# EasyEDA schematic easyeda_source_code.json
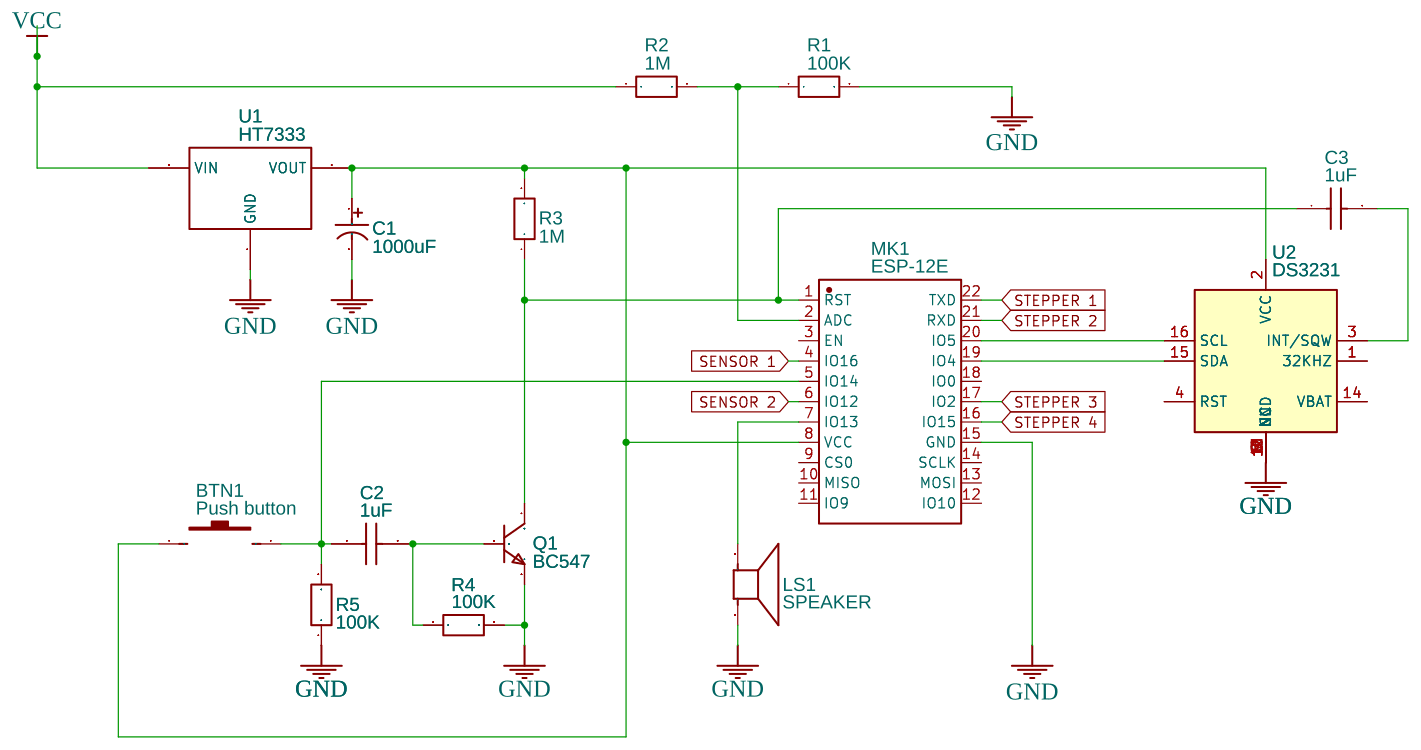
[diagram p0: schematic sheet]

## Parts
BTN1  Push button  [KEY-3.0*4.0]
C1  1000uF  [CAP-TH_BD10.0-P5.00-D1.0-FD]
C2  1uF  [&#126;]
C3  1uF  [&#126;]
LS1  SPEAKER  [PS12]
MK1  ESP-12E  [WIFIM-SMD_ESP-12E]
Q1  BC547  [TO-92-3_L4.8-W3.7-P2.54-L]
R1  100K  [R0201]
R2  1M  [R0201]
R3  1M  [R0201]
R4  100K  [R0201]
R5  100K  [R0201]
U1  HT7333  [TO-92-3_L5.1-W4.1-P1.27-L]
U2  DS3231  [SOIC-16_7.5X10.3MM_PITCH1.27MM]

## Library data of the parts
BTN1 = Switch3x4x2: Supplier: LCSC; Manufacturer: ReliaPro; Supplier Part: C26638
C1 = 1000uF 10V 10*15: Supplier: LCSC; Manufacturer: ValuePro; Manufacturer Part: 1000uF 10V绿金 10*15; Supplier Part: C43339
C2 C3 = CAPACITOR_RevE_Date15jun2010: Contributor: KiCAD; license: https://www.gnu.org/licenses/lgpl-2.1.html
LS1 = SPEAKERPS12: SPEAKER Source: BuerklinAdded PS12 (for part # PS1240 piezo) http:www.ladyada.netlibrarypcbeaglelibrary.html; Contributor: Adafruit
MK1 = ESP-12E: Supplier: LCSC; Manufacturer: Ai-Thinker; Supplier Part: C89297
Q1 = BC547BTA: Supplier: LCSC; Supplier Part: C258144; Manufacturer: ON Semicon; Contributor: LCSC
R1-R5 = R_0201_EU: Contributor: LCEDA_Lib
U1 = HT7333-A_C73726: Supplier: LCSC; Supplier Part: C73726; Manufacturer: Holtek Semicon; Manufacturer Part: HT7333-A; Contributor: LCSC
U2 = DS3231: Contributor: KiCAD; license: https://www.gnu.org/licenses/lgpl-2.1.html

## Nets
GND: C1.2 LS1.P$2(-) MK1.15(GND) Q1.3(E) R1.2 R4.2 R5.1 U1.1(GND) U2.5(NC) U2.6(NC) U2.7(NC) U2.8(NC) U2.9(NC) U2.10(NC) U2.11(NC) U2.12(NC) U2.13(GND)
VCC: R2.1 U1.2(VIN)
SENSOR 1: MK1.4(IO16)
SENSOR 2: MK1.6(IO12)
STEPPER 1: MK1.22(TXD)
STEPPER 2: MK1.21(RXD)
STEPPER 3: MK1.17(IO2)
STEPPER 4: MK1.16(IO15)
Net-(BTN1-1): BTN1.1 C1.1 MK1.8(VCC) R3.2 U1.3(VOUT) U2.2(VCC)
Net-(BTN1-2): BTN1.2 C2.1 MK1.5(IO14) R5.2
Net-(C2-2): C2.2 Q1.2(B) R4.1
Net-(C3-1): C3.1 MK1.1(RST) Q1.1(C) R3.1
Net-(C3-2): C3.2 U2.3(INT/SQW)
Net-(LS1-P$1): LS1.P$1(+) MK1.7(IO13)
Net-(MK1-2): MK1.2(ADC) R1.1 R2.2
Net-(MK1-19): MK1.19(IO4) U2.15(SDA)
Net-(MK1-20): MK1.20(IO5) U2.16(SCL)

Not connected (* = marked no-connect by the designer): MK1 3(EN) 9(CS0) 10(MISO) 11(IO9) 12(IO10) 13(MOSI) 14(SCLK) 18(IO0); U2 1(32KHZ) 4(RST) 14(VBAT)
